# Altium project Payload_Switch_Board.PrjPcb
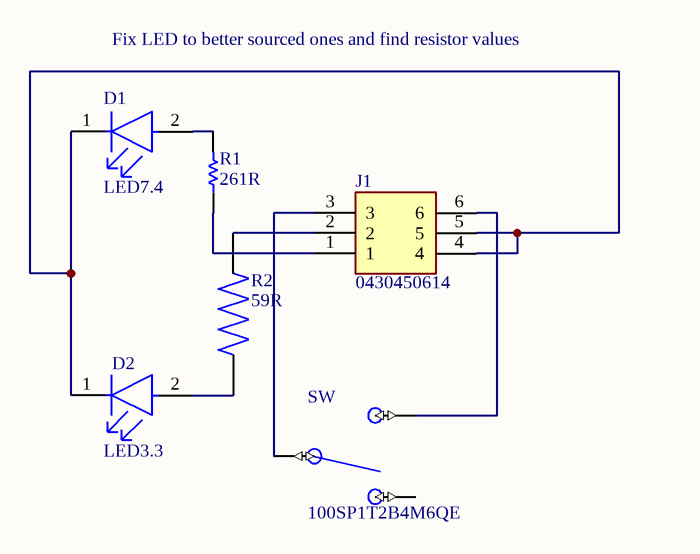
[diagram p0: Payload_Switch_Board.SchDoc]
1 sheet, 6 parts. Net scope: global (net labels, ports and power ports of the same name join across sheets).
Board file: Payload_Switch_Board.PcbDoc

## Sheet Payload_Switch_Board.SchDoc
size A4; SheetNumber: 1; SheetTotal: 1

### Parts
D1  LED7.4  [FP-APHHS1005CGCK-MFG]
D2  LED3.3  [FP-APHHS1005CGCK-MFG]
J1  0430450614  [0430450614]
R1  261R  [RESC3216X70X50NL05T20]
R2  59R  [RES_ERJP06F59R0V]
SW  100SP1T2B4M6QE  [TOGGLE_RA]

### Nets
NetD1_1: D1.1(C) D2.1(C) J1.4 J1.5
NetD1_2: D1.2(A) R1.2
NetD2_2: D2.2(A) R2.1
NetJ1_1: J1.1 R1.1
NetJ1_2: J1.2 R2.2
NetJ1_3: J1.3 SW.2(COM)
NetJ1_6: J1.6 SW.1(P$2)

Not connected (* = marked no-connect by the designer): SW 3(P$3)

### Notes on the sheet
- Fix LED to better sourced ones and find resistor values

### Library data of the parts
D1 D2 = CMP-44529-000044-1: LED GREEN CLEAR CHIP SMD; Viewing Angle: 120°; Dominant Wavelength: 570nm; Test Current: 20mA; Luminous Intensity: 50mcd; Forward Voltage: 2.1V; Number of LEDs: 1; Lens Color: Clear; Packaging: Tape and Reel; Max Operating Temperature: 85°C; Illumination Color: Green; Length: 1mm; Mount: Surface Mount; Lens Style: Clear; Color: Green; Number of Pins: 2; Wavelength: 570nm; Case/Package: 0402; Width: 0.5mm; Package Quantity: 2000; Case Code (Metric): 1005; Height: 0.6mm; Lead Free: Lead Free; Case Code (Imperial): 0402; Forward Current: 20mA; Min Operating Temperature: -40°C
J1 = 0430450614: Connector; Manufacturer_Name: Molex; Datasheet Link: https://www.molex.com/pdm_docs/sd/430450614_sd.pdf; Height: 10.16mm; Manufacturer_Part_Number: 0430450614; Mouser Part Number: N/A; Mouser Price/Stock: https://www.mouser.co.uk/ProductDetail/Molex/0430450614?qs=PBcRNPEHKsqC6mUhVPlcHQ%3D%3D; Arrow Part Number: 0430450614; Arrow Price/Stock: https://www.arrow.com/en/products/0430450614/molex?region=nac
R1 = CMP-2003-00255-1: Manufacturer: Panasonic; Part Number: ERJ-8ENF2610V
R2 = ERJP06F59R0V: Package: None; MP: ERJP06F59R0V; Value: *; Price: None; Availability: Unavailable
SW = 100SP1T2B4M6QE: Toggle Switch SPDT Through Hole, Right Angle; MF: E-Switch; Value: *; Package: None; Price: None; MP: 100SP1T2B4M6QE; Availability: Unavailable; SnapEDA_Link: https://www.snapeda.com/parts/100SP1T2B4M6QE/E-Switch/view-part/584067/?ref=snap